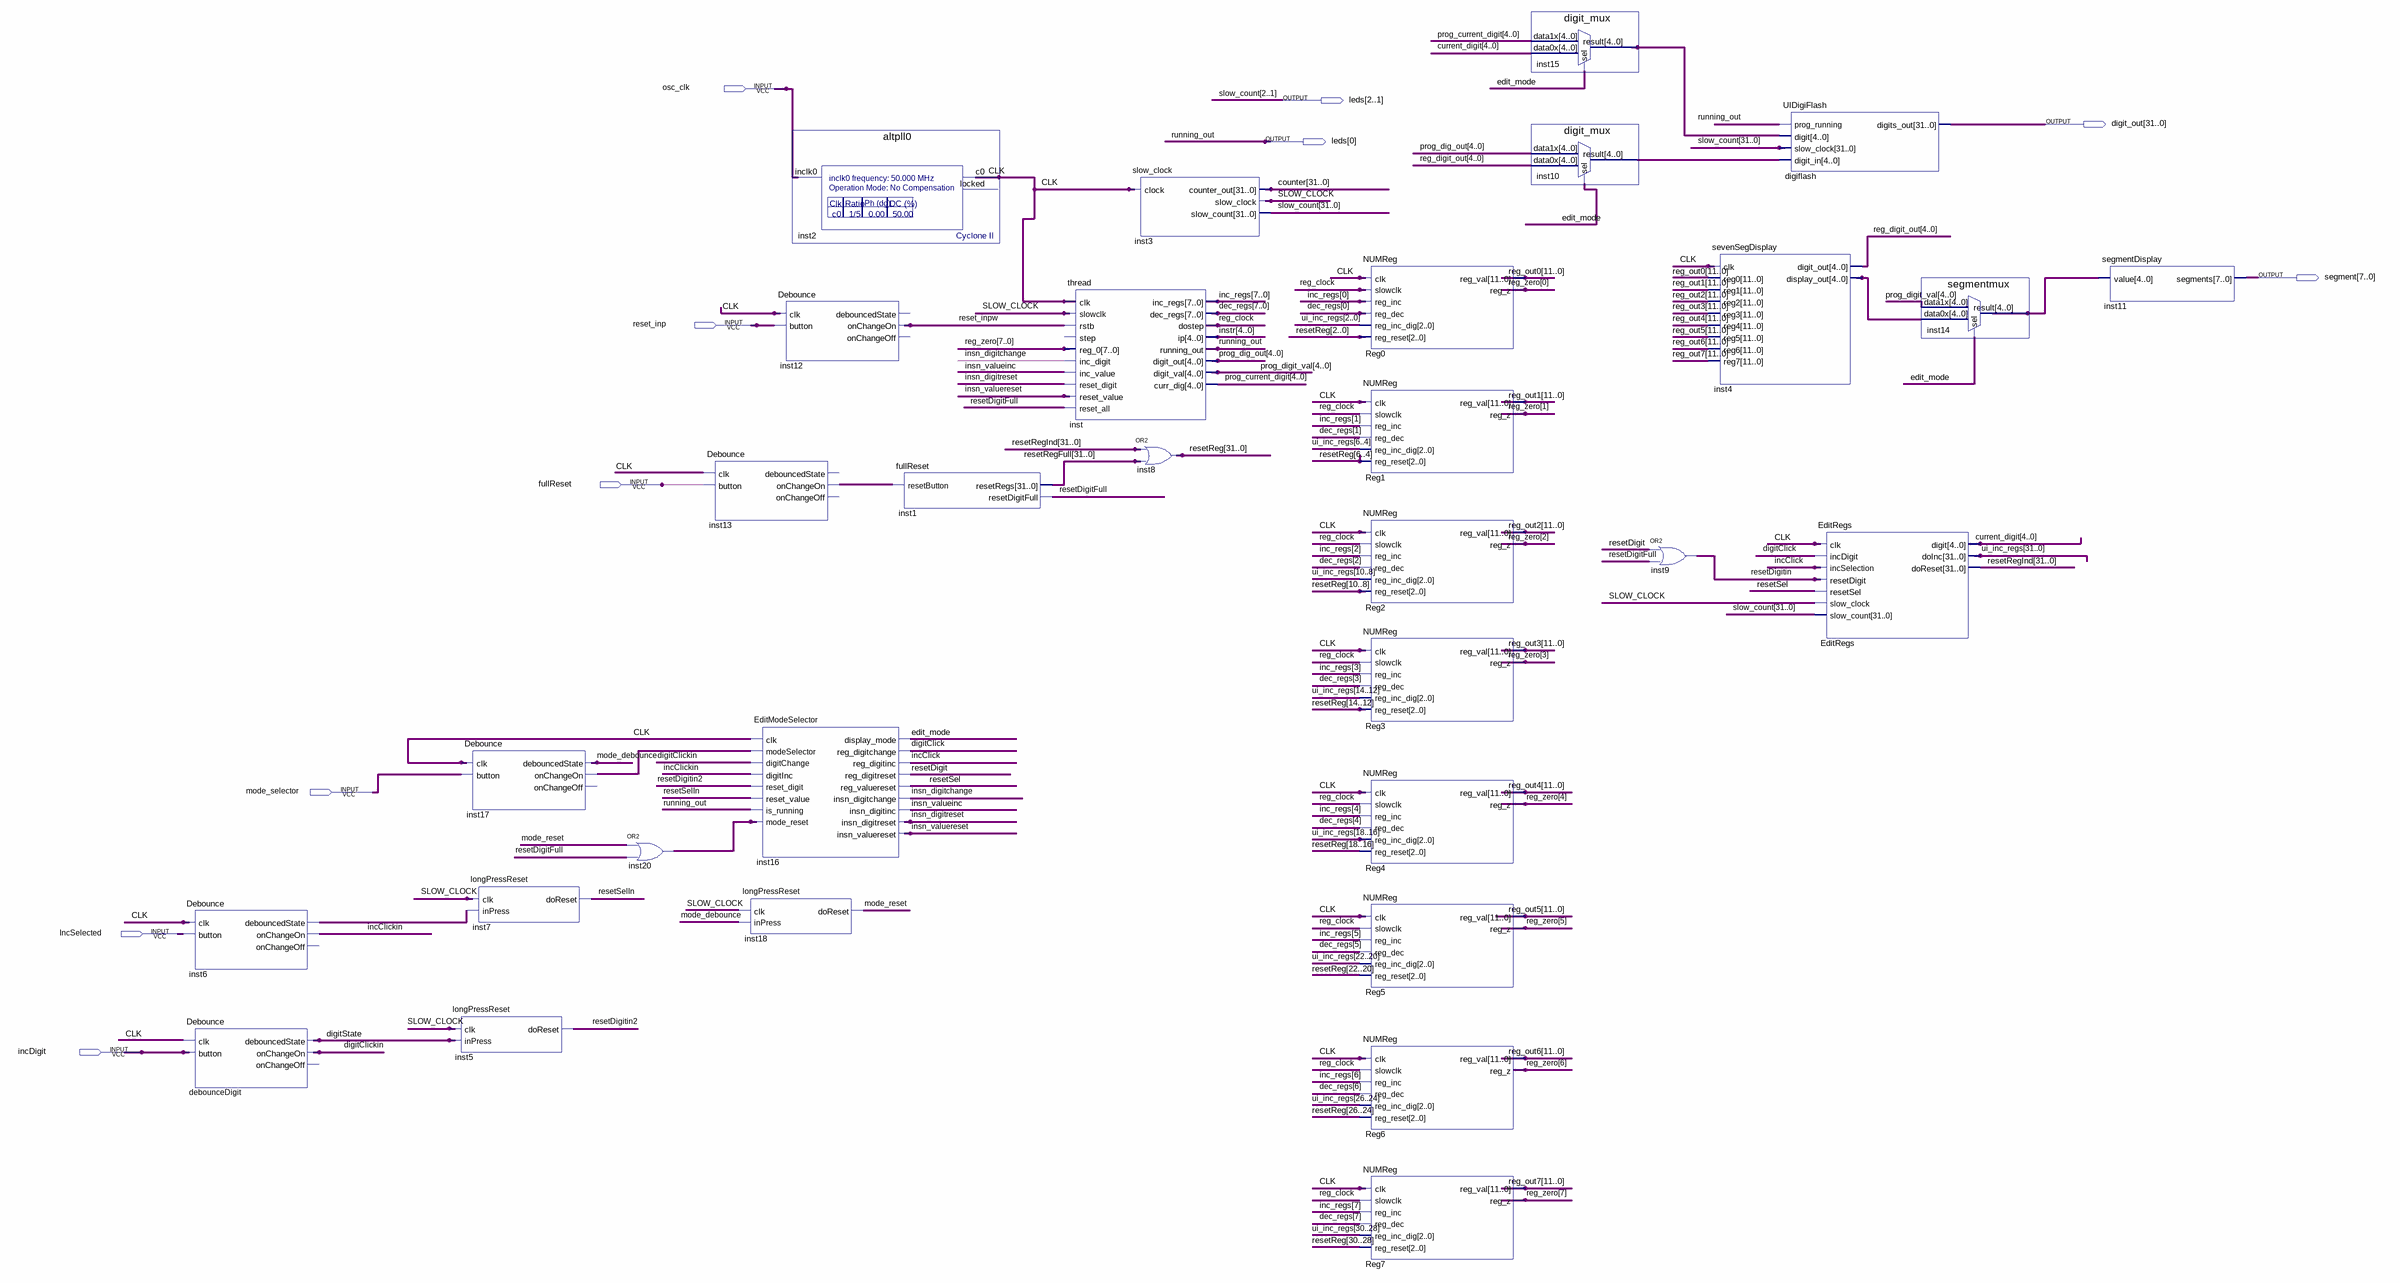
[diagram p0: schematic sheet]
// Quartus schematic numbotron.bdf as structural Verilog: 31 symbols, 10 pins
module numbotron (
  input  osc_clk,
  input  reset_inp,
  input  fullReset,
  input  mode_selector,
  input  IncSelected,
  input  incDigit,
  output [2:0] leds,
  output [31:0] digit_out,
  output [7:0] segment
);

  wire CLK, digitClick, digitClickin, digitState, edit_mode, incClick, incClickin, insn_digitchange,
       insn_digitreset, insn_valueinc, insn_valuereset, inst6_debouncedstate, inst13_onchangeon,
       inst17_onchangeon, inst20_out, mode_debounce, mode_reset, reg_clock, reset_inpw, resetDigit,
       resetDigitFull, resetDigitin, resetDigitin2, resetSel, resetSelIn, SLOW_CLOCK;
  wire [4:0] current_digit, inst4_display_out, inst10_result, inst14_result, inst15_result, instr,
       prog_current_digit, prog_dig_out, prog_digit_val, reg_digit_out;
  wire [7:0] dec_regs, inc_regs, reg_zero;
  wire [11:0] reg_out0, reg_out1, reg_out2, reg_out3, reg_out4, reg_out5, reg_out6, reg_out7;
  wire [31:0] counter, resetReg, resetRegFull, resetRegInd, slow_count, ui_inc_regs;

  Debounce inst6 (
    .clk(CLK), .button(IncSelected), .debouncedState(inst6_debouncedstate), .onChangeOn(incClickin));  // open: onChangeOff
  Debounce debounceDigit (
    .clk(CLK), .button(incDigit), .debouncedState(digitState), .onChangeOn(digitClickin));  // open: onChangeOff
  Debounce inst17 (
    .clk(CLK), .button(mode_selector), .debouncedState(mode_debounce), .onChangeOn(inst17_onchangeon));  // open: onChangeOff
  longPressReset inst7 (.clk(SLOW_CLOCK), .inPress(inst6_debouncedstate), .doReset(resetSelIn));
  longPressReset inst5 (.clk(SLOW_CLOCK), .inPress(digitState), .doReset(resetDigitin2));
  or inst20 (inst20_out, mode_reset, resetDigitFull);
  Debounce inst13 (.clk(CLK), .button(fullReset), .onChangeOn(inst13_onchangeon));  // open: debouncedState, onChangeOff
  EditModeSelector inst16 (
    .clk(CLK), .modeSelector(inst17_onchangeon), .digitChange(digitClickin), .digitInc(incClickin),
    .reset_digit(resetDigitin2), .reset_value(resetSelIn), .is_running(leds[0]), .mode_reset(inst20_out),
    .display_mode(edit_mode), .reg_digitchange(digitClick), .reg_digitinc(incClick),
    .reg_digitreset(resetDigit), .reg_valuereset(resetSel), .insn_digitchange(insn_digitchange),
    .insn_digitinc(insn_valueinc), .insn_digitreset(insn_digitreset), .insn_valuereset(insn_valuereset));
  longPressReset inst18 (.clk(SLOW_CLOCK), .inPress(mode_debounce), .doReset(mode_reset));
  altpll0 inst2 (.inclk0(osc_clk), .c0(CLK));  // open: locked
  Debounce inst12 (.clk(CLK), .button(reset_inp), .onChangeOn(reset_inpw));  // open: debouncedState, onChangeOff
  fullReset inst1 (.resetButton(inst13_onchangeon), .resetRegs(resetRegFull), .resetDigitFull(resetDigitFull));
  thread inst (
    .clk(CLK), .slowclk(SLOW_CLOCK), .rstb(reset_inpw), .reg_0(reg_zero), .inc_digit(insn_digitchange),
    .inc_value(insn_valueinc), .reset_digit(insn_digitreset), .reset_value(insn_valuereset),
    .reset_all(resetDigitFull), .inc_regs(inc_regs), .dec_regs(dec_regs), .dostep(reg_clock), .ip(instr),
    .running_out(leds[0]), .digit_out(prog_dig_out), .digit_val(prog_digit_val), .curr_dig(prog_current_digit));  // open: step
  slow_clock inst3 (
    .clock(CLK), .counter_out(counter), .slow_clock(SLOW_CLOCK),
    .slow_count({slow_count[31:3], leds[2:1], slow_count[0]}));
  assign resetReg = resetRegInd | resetRegFull;  // OR2 inst8, 32 bits wide
  NUMReg Reg0 (
    .clk(CLK), .slowclk(reg_clock), .reg_inc(inc_regs[0]), .reg_dec(dec_regs[0]),
    .reg_inc_dig(ui_inc_regs[2:0]), .reg_reset(resetReg[2:0]), .reg_val(reg_out0), .reg_z(reg_zero[0]));
  NUMReg Reg1 (
    .clk(CLK), .slowclk(reg_clock), .reg_inc(inc_regs[1]), .reg_dec(dec_regs[1]),
    .reg_inc_dig(ui_inc_regs[6:4]), .reg_reset(resetReg[6:4]), .reg_val(reg_out1), .reg_z(reg_zero[1]));
  NUMReg Reg2 (
    .clk(CLK), .slowclk(reg_clock), .reg_inc(inc_regs[2]), .reg_dec(dec_regs[2]),
    .reg_inc_dig(ui_inc_regs[10:8]), .reg_reset(resetReg[10:8]), .reg_val(reg_out2), .reg_z(reg_zero[2]));
  NUMReg Reg3 (
    .clk(CLK), .slowclk(reg_clock), .reg_inc(inc_regs[3]), .reg_dec(dec_regs[3]),
    .reg_inc_dig(ui_inc_regs[14:12]), .reg_reset(resetReg[14:12]), .reg_val(reg_out3), .reg_z(reg_zero[3]));
  NUMReg Reg4 (
    .clk(CLK), .slowclk(reg_clock), .reg_inc(inc_regs[4]), .reg_dec(dec_regs[4]),
    .reg_inc_dig(ui_inc_regs[18:16]), .reg_reset(resetReg[18:16]), .reg_val(reg_out4), .reg_z(reg_zero[4]));
  NUMReg Reg5 (
    .clk(CLK), .slowclk(reg_clock), .reg_inc(inc_regs[5]), .reg_dec(dec_regs[5]),
    .reg_inc_dig(ui_inc_regs[22:20]), .reg_reset(resetReg[22:20]), .reg_val(reg_out5), .reg_z(reg_zero[5]));
  NUMReg Reg6 (
    .clk(CLK), .slowclk(reg_clock), .reg_inc(inc_regs[6]), .reg_dec(dec_regs[6]),
    .reg_inc_dig(ui_inc_regs[26:24]), .reg_reset(resetReg[26:24]), .reg_val(reg_out6), .reg_z(reg_zero[6]));
  NUMReg Reg7 (
    .clk(CLK), .slowclk(reg_clock), .reg_inc(inc_regs[7]), .reg_dec(dec_regs[7]),
    .reg_inc_dig(ui_inc_regs[30:28]), .reg_reset(resetReg[30:28]), .reg_val(reg_out7), .reg_z(reg_zero[7]));
  digit_mux inst15 (.data1x(prog_current_digit), .data0x(current_digit), .sel(edit_mode), .result(inst15_result));
  digit_mux inst10 (.data1x(prog_dig_out), .data0x(reg_digit_out), .sel(edit_mode), .result(inst10_result));
  or inst9 (resetDigitin, resetDigit, resetDigitFull);
  sevenSegDisplay inst4 (
    .clk(CLK), .reg0(reg_out0), .reg1(reg_out1), .reg2(reg_out2), .reg3(reg_out3), .reg4(reg_out4),
    .reg5(reg_out5), .reg6(reg_out6), .reg7(reg_out7), .digit_out(reg_digit_out),
    .display_out(inst4_display_out));
  UIDigiFlash digiflash (
    .prog_running(leds[0]), .digit(inst15_result), .slow_clock({slow_count[31:3], leds[2:1], slow_count[0]}),
    .digit_in(inst10_result), .digits_out(digit_out));
  EditRegs EditRegs (
    .clk(CLK), .incDigit(digitClick), .incSelection(incClick), .resetDigit(resetDigitin),
    .resetSel(resetSel), .slow_clock(SLOW_CLOCK), .slow_count({slow_count[31:3], leds[2:1], slow_count[0]}),
    .digit(current_digit), .doInc(ui_inc_regs), .doReset(resetRegInd));
  segmentmux inst14 (.data1x(prog_digit_val), .data0x(inst4_display_out), .sel(edit_mode), .result(inst14_result));
  segmentDisplay inst11 (.value(inst14_result), .segments(segment));

  // Other names for the same wires on the sheet: running_out = leds[0]; slow_count[2:1] = leds[2:1]
endmodule
